# EAGLE design decision (EAGLE 7.6.0)
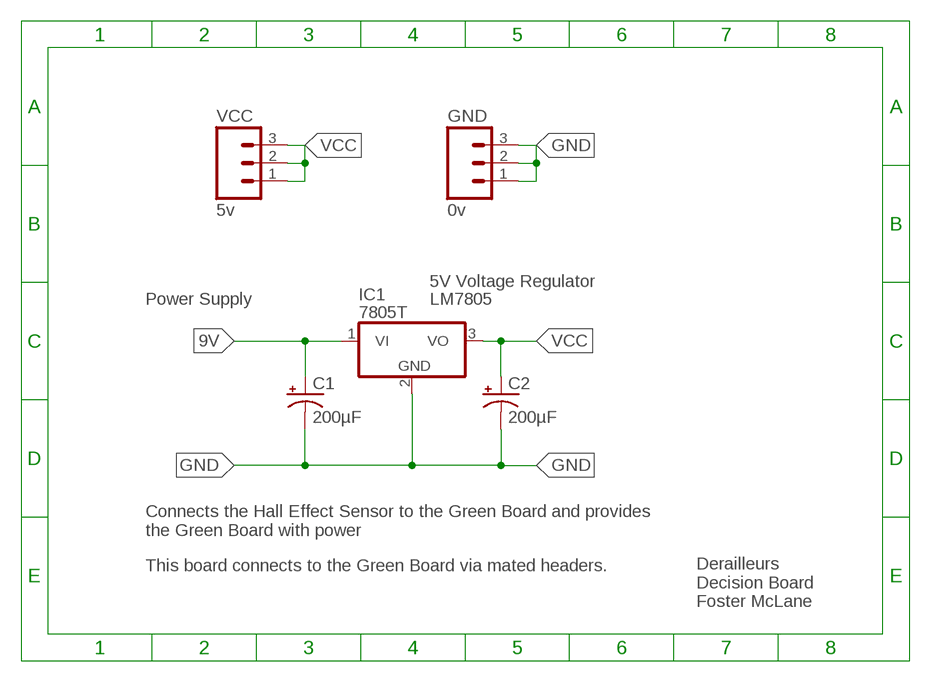
[diagram p0: schematic, sheet 1]

## Parts
C1  200µF  CAP_POLPTH1  [CPOL-RADIAL-100UF-25V]
C2  200µF  CAP_POLPTH1  [CPOL-RADIAL-100UF-25V]
GND  0v  M03PTH  [1X03]
IC1  7805T  [TO220H]
VCC  5v  M03PTH  [1X03]

## Nets
9V: C1.1(+) IC1.1(VI)
GND: C1.2(-) C2.2(-) GND.1 GND.2 GND.3 IC1.2(GND)
VCC: C2.1(+) IC1.3(VO) VCC.1 VCC.2 VCC.3

## Notes on the sheet
- 5V Voltage Regulator
- Power Supply | LM7805
- Connects the Hall Effect Sensor to the Green Board and provides
  the Green Board with power
- This board connects to the Green Board via mated headers.
- Derailleurs
  Decision Board
  Foster McLane

## Library data of the parts
C1 C2 = SparkFun-Capacitors:CAP_POL: Capacitor Polarized These are standard SMD and PTH capacitors. Normally 10uF, 47uF, and 100uF in electrolytic and tantalum varieties. Always verify the external diameter of the through hole cap, it varies with capacity, voltage, and manufacturer. The EIA devices should be standard.
GND VCC = SparkFun-Connectors:M03: Header 3 Standard 3-pin 0.1" header. Use with straight break away headers (SKU : PRT-00116), right angle break away headers (PRT-00553), swiss pins (PRT-00743), machine pins (PRT-00117), and female headers (PRT-00115). Molex polarized connector foot print use with SKU : PRT-08232 with associated crimp pins and housings.
IC1 = linear:78*: Positive VOLTAGE REGULATOR Source: http://cache.national.com/ds/LM/LM78L05.pdf http://www.fairchildsemi.com/ds/LM/LM7805.pdf

## Board
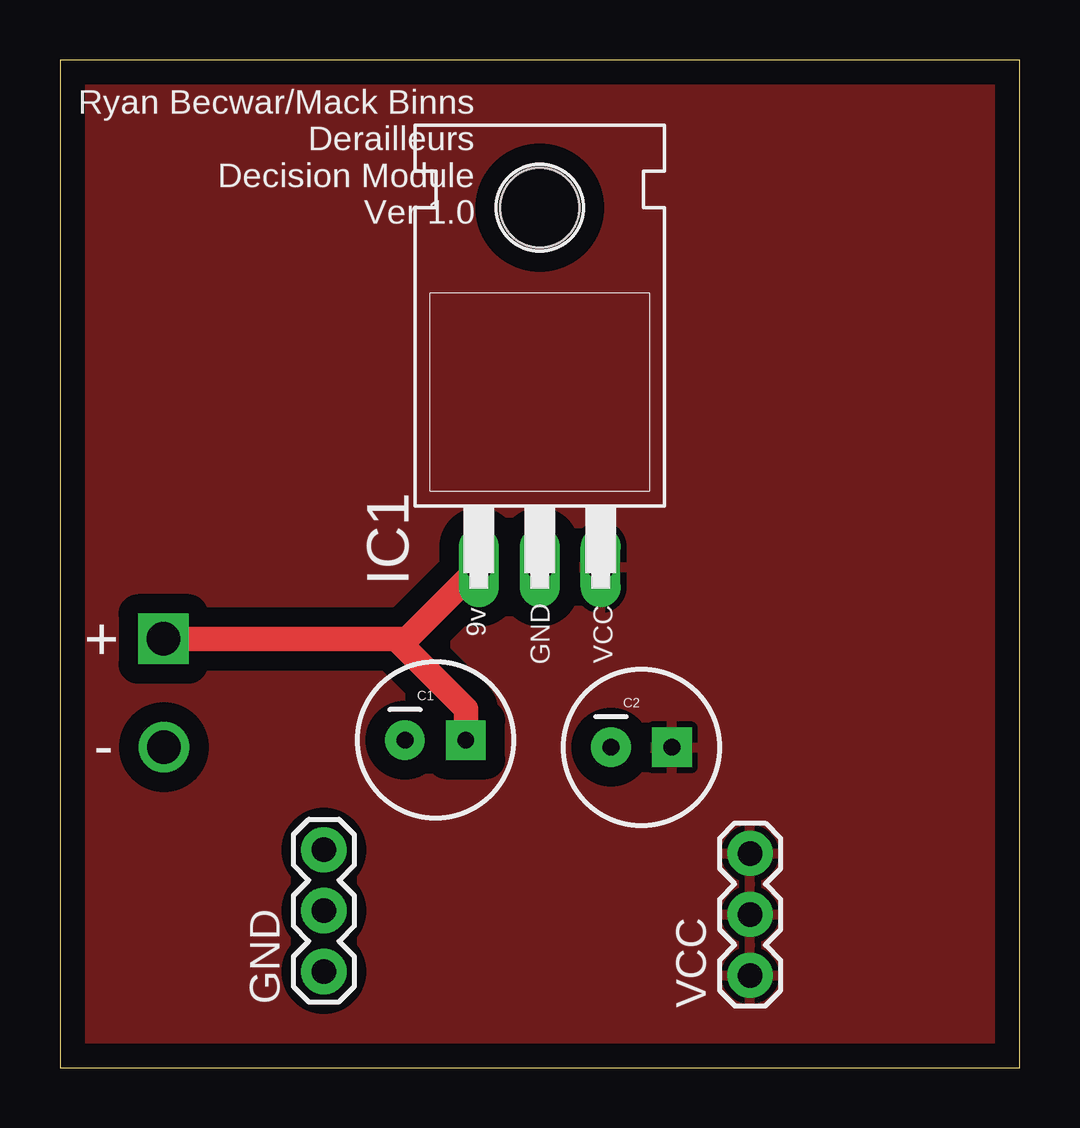
[diagram p1: board, top side]
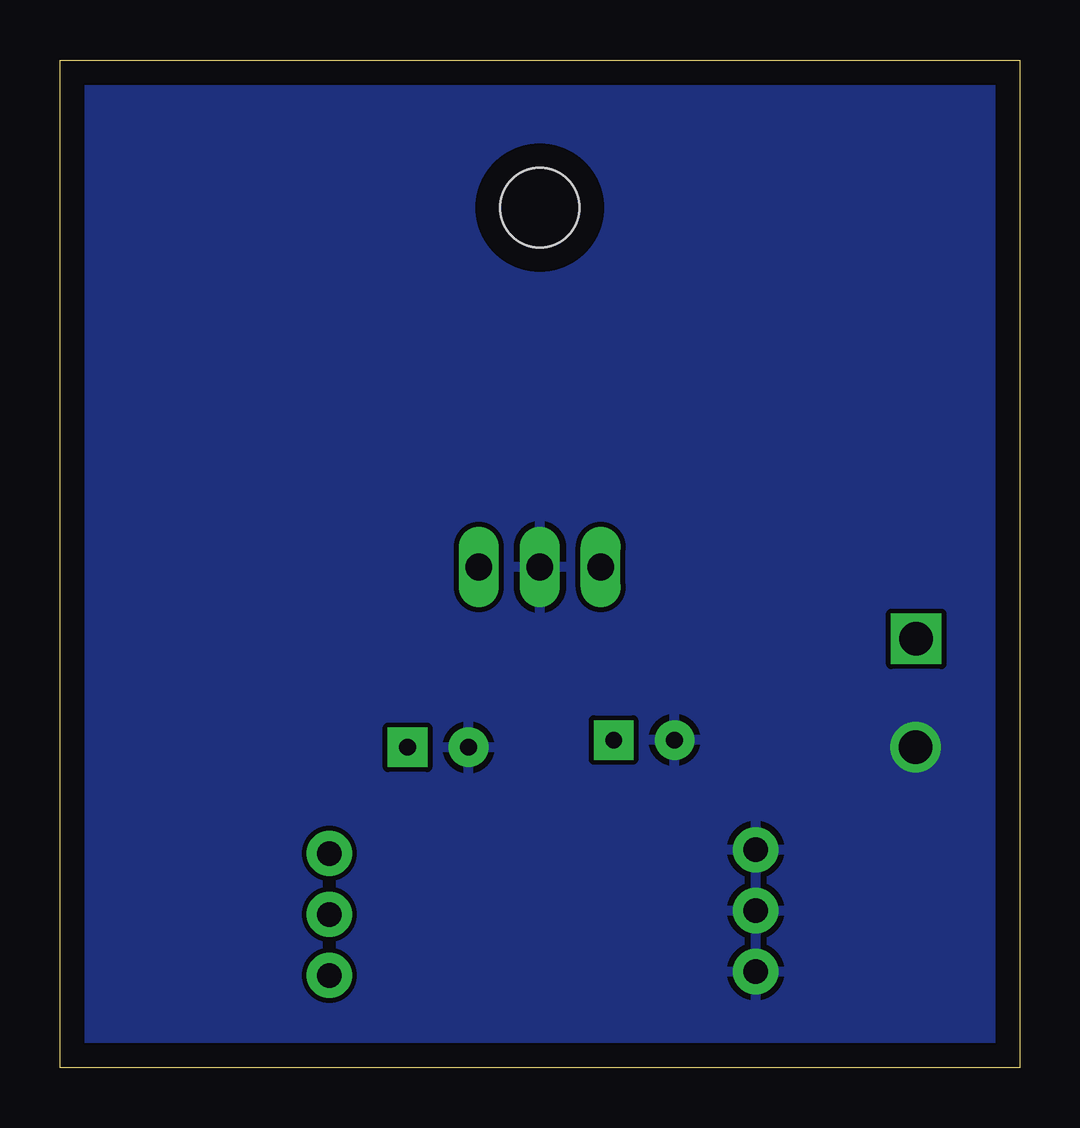
[diagram p2: board, bottom side, seen from below]

Size 40 x 42 mm. Coordinates in mm from the lower left corner, seen from the top.
Outline: 0,0 40,0 40,42 0,42 0,0
Copper layers (1*16): Top 0.035mm / dielectric 1.5mm / Bottom 0.035mm
Design rules "default": minimum track width 10mil, minimum drill 24mil, track to track 8mil, track to pad 8mil, pad to pad 8mil, via to via 8mil, smd to smd 8mil, copper to edge 40mil, drill to drill 8mil, minimum pad ring 10mil, minimum via ring 8mil, stop-mask expansion 4mil, vias tented up to drill 0mil, thermal gap 10mil

### Footprints (pad centres in the part's own frame; a part is rotated, then mirrored left to right if it is on the bottom)
CPOL-RADIAL-100UF-25V = drill 0.7 pad 1.651 square: 1 1.27,0 | drill 0.7 pad 1.651: 2 -1.27,0
1X03 = drill 1.016 pad 1.88: 1 0,0; 2 2.54,0; 3 5.08,0
TO220H = drill 1.118 long: 1 -2.54,-10.16; 2 0,-10.16; 3 2.54,-10.16 | hole 3.302: 0,4.826

### Placement (x,y rotation side)
C1  15.65,13.65 0 top
C2  24.24,13.35 0 top
GND  11,4 90 top
IC1  20,31.02 0 top
VCC  28.77,3.84 90 top

### Tracks (layer width: path | path; a pad name or v marks a point on that pad's centre or on a via)
9V  (via drill 1.4)
  Top 1.016: IC1.1 14.38,17.78 14.29,17.87 14,17.87 | v4.31,17.87 14,17.87 | C1.1 16.92,14.95 14,17.87
GND  (via drill 1.4)
  other vias: 4.33,13.35
  pour Bottom: 0,42 40,42 40,0 0,0
VCC
  pour Top (isolate 0.813): 0,42 40,42 40,0 0,0

### Text on the board
_tsilk: Ryan Becwar/Mack Binns / Derailleurs / Decision Module / Ver 1.0 | 9v | + | GND | VCC | -